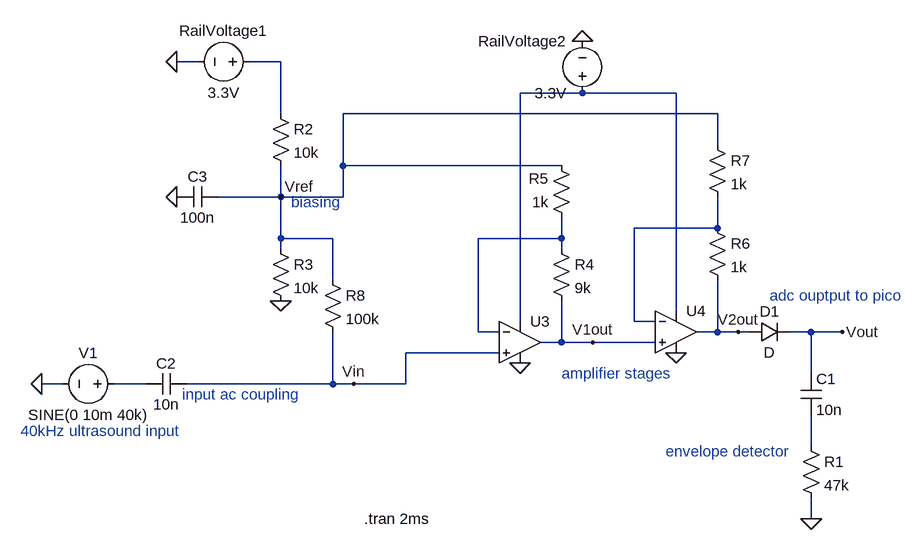
[diagram p0: schematic ultrasound_detector.asc]
ultrasound_detector.asc, the LTspice schematic file:
Version 4.1
SHEET 1 880 692
WIRE -496 -288 -528 -288
WIRE -368 -288 -416 -288
WIRE 96 -240 0 -240
WIRE 240 -240 96 -240
WIRE -368 -208 -368 -288
WIRE 304 -208 -272 -208
WIRE 304 -160 304 -208
WIRE -272 -128 -272 -208
WIRE 64 -128 -272 -128
WIRE -368 -80 -368 -128
WIRE -368 -80 -464 -80
WIRE -272 -80 -272 -128
WIRE -272 -80 -368 -80
WIRE 304 -32 304 -80
WIRE 304 -32 176 -32
WIRE -368 -16 -368 -80
WIRE -288 -16 -368 -16
WIRE 64 -16 64 -48
WIRE 64 -16 -64 -16
WIRE -368 0 -368 -16
WIRE 64 0 64 -16
WIRE -288 48 -288 -16
WIRE 240 96 240 -240
WIRE 0 112 0 -240
WIRE 176 112 176 -32
WIRE 208 112 176 112
WIRE -64 128 -64 -16
WIRE -32 128 -64 128
WIRE 304 128 304 48
WIRE 304 128 272 128
WIRE 336 128 304 128
WIRE 352 128 336 128
WIRE 448 128 416 128
WIRE 496 128 448 128
WIRE 64 144 64 80
WIRE 64 144 32 144
WIRE 112 144 64 144
WIRE 208 144 112 144
WIRE -32 160 -176 160
WIRE 448 192 448 128
WIRE -704 208 -736 208
WIRE -576 208 -624 208
WIRE -288 208 -288 128
WIRE -288 208 -512 208
WIRE -256 208 -288 208
WIRE -176 208 -176 160
WIRE -176 208 -256 208
WIRE 448 304 448 256
WIRE 448 416 448 384
FLAG -736 208 0
FLAG 496 128 Vout
FLAG 448 416 0
FLAG -368 80 0
FLAG -528 -288 0
FLAG 96 -320 0
FLAG 0 176 0
FLAG 240 160 0
FLAG 336 128 V2out
FLAG 112 144 V1out
FLAG -256 208 Vin
FLAG -368 -80 Vref
FLAG -528 -80 0
SYMBOL voltage -608 208 R90
WINDOW 0 -32 56 VBottom 2
WINDOW 3 32 56 VTop 2
WINDOW 123 0 0 Left 0
WINDOW 39 0 0 Left 0
SYMATTR InstName V1
SYMATTR Value SINE(0 10m 40k)
SYMBOL diode 352 144 R270
WINDOW 0 32 32 VTop 2
WINDOW 3 0 32 VBottom 2
SYMATTR InstName D1
SYMBOL cap 432 192 R0
SYMATTR InstName C1
SYMATTR Value 10n
SYMBOL res 432 288 R0
SYMATTR InstName R1
SYMATTR Value 47k
SYMBOL res -384 -224 R0
SYMATTR InstName R2
SYMATTR Value 10k
SYMBOL res -384 -16 R0
SYMATTR InstName R3
SYMATTR Value 10k
SYMBOL voltage -400 -288 R90
WINDOW 0 -32 56 VBottom 2
WINDOW 3 32 56 VTop 2
SYMATTR InstName RailVoltage1
SYMATTR Value 3.3V
SYMBOL res 48 -16 R0
SYMATTR InstName R4
SYMATTR Value 9k
SYMBOL res 80 -32 R180
WINDOW 0 36 76 Left 2
WINDOW 3 36 40 Left 2
SYMATTR InstName R5
SYMATTR Value 1k
SYMBOL res 288 -48 R0
SYMATTR InstName R6
SYMATTR Value 1k
SYMBOL res 288 -176 R0
SYMATTR InstName R7
SYMATTR Value 1k
SYMBOL cap -512 192 R90
WINDOW 0 0 32 VBottom 2
WINDOW 3 32 32 VTop 2
SYMATTR InstName C2
SYMATTR Value 10n
SYMBOL OpAmps\\UniversalOpAmp2 0 144 R0
SYMATTR InstName U3
SYMBOL OpAmps\\UniversalOpAmp2 240 128 R0
SYMATTR InstName U4
SYMBOL voltage 96 -224 R180
WINDOW 0 24 96 Left 2
WINDOW 3 24 16 Left 2
SYMATTR InstName RailVoltage2
SYMATTR Value 3.3V
SYMBOL cap -464 -96 R90
WINDOW 0 0 32 VBottom 2
WINDOW 3 32 32 VTop 2
SYMATTR InstName C3
SYMATTR Value 100n
SYMBOL res -304 32 R0
SYMATTR InstName R8
SYMATTR Value 100k
TEXT -240 416 Left 2 !.tran 2ms
TEXT -520 224 Left 2 ;input ac coupling
TEXT -352 -72 Left 2 ;biasing
TEXT 64 192 Left 2 ;amplifier stages
TEXT 224 312 Left 2 ;envelope detector
TEXT 384 72 Left 2 ;adc ouptput to pico
TEXT -768 280 Left 2 ;40kHz ultrasound input

The netlist it stands for:
* ultrasound_detector.asc
V1 N005 0 SINE(0 10m 40k)
D1 V2out Vout D
C1 Vout N006 10n
R1 N006 0 47k
R2 N001 Vref 10k
R3 Vref 0 10k
V§RailVoltage1 N001 0 3.3V
R4 N004 V1out 9k
R5 N004 Vref 1k
R6 N003 V2out 1k
R7 Vref N003 1k
C2 Vin N005 10n
X§U3 Vin N004 N002 0 V1out level2 Avol=1Meg GBW=10Meg Slew=10Meg Ilimit=25m Rail=0 Vos=0 En=0 Enk=0 In=0 Ink=0 Rin=500Meg  ; pins In+ In- V+ V- OUT
X§U4 V1out N003 N002 0 V2out level2 Avol=1Meg GBW=10Meg Slew=10Meg Ilimit=25m Rail=0 Vos=0 En=0 Enk=0 In=0 Ink=0 Rin=500Meg  ; pins In+ In- V+ V- OUT
V§RailVoltage2 N002 0 3.3V
C3 Vref 0 100n
R8 Vref Vin 100k
.model D D
.lib standard.dio
.tran 2ms
* input ac coupling
* biasing
* amplifier stages
* envelope detector
* adc ouptput to pico
* 40kHz ultrasound input
.lib UniversalOpAmp2.lib
.backanno
.end